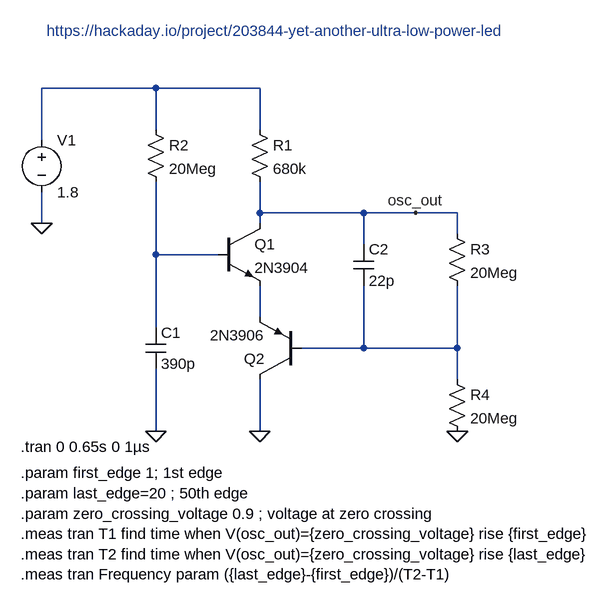
[diagram p0: schematic very_low_power.asc]
very_low_power.asc, the LTspice schematic file:
Version 4
SHEET 1 880 680
WIRE 0 -96 -176 -96
WIRE 160 -96 0 -96
WIRE 0 -32 0 -96
WIRE 160 -32 160 -96
WIRE -176 -16 -176 -96
WIRE 160 96 160 48
WIRE 320 96 160 96
WIRE 400 96 320 96
WIRE 464 96 400 96
WIRE -176 112 -176 64
WIRE 160 112 160 96
WIRE 464 128 464 96
WIRE 320 144 320 96
WIRE 0 160 0 48
WIRE 96 160 0 160
WIRE 160 256 160 208
WIRE 0 272 0 160
WIRE 320 304 320 208
WIRE 320 304 224 304
WIRE 464 304 464 208
WIRE 464 304 320 304
WIRE 464 352 464 304
WIRE 0 432 0 336
WIRE 160 432 160 352
FLAG 0 432 0
FLAG 160 432 0
FLAG 464 432 0
FLAG -176 112 0
FLAG 400 96 osc_out
SYMBOL npn 96 112 R0
SYMATTR InstName Q1
SYMATTR Value 2N3904
SYMBOL pnp 224 352 R180
SYMATTR InstName Q2
SYMATTR Value 2N3906
SYMBOL res 144 -48 R0
SYMATTR InstName R1
SYMATTR Value 680k
SYMBOL res -16 -48 R0
SYMATTR InstName R2
SYMATTR Value 20Meg
SYMBOL cap -16 272 R0
SYMATTR InstName C1
SYMATTR Value 390p
SYMBOL cap 304 144 R0
SYMATTR InstName C2
SYMATTR Value 22p
SYMBOL res 448 112 R0
SYMATTR InstName R3
SYMATTR Value 20Meg
SYMBOL res 448 336 R0
SYMATTR InstName R4
SYMATTR Value 20Meg
SYMBOL voltage -176 -32 R0
SYMATTR InstName V1
SYMATTR Value 1.8
TEXT -208 456 Left 2 !.tran 0 0.65s 0 1µs
TEXT -168 -184 Left 2 ;https://hackaday.io/project/203844-yet-another-ultra-low-power-led
TEXT -208 496 Left 2 !.param first_edge 1; 1st edge\n.param last_edge=20 ; 50th edge\n.param zero_crossing_voltage 0.9 ; voltage at zero crossing\n.meas tran T1 find time when V(osc_out)={zero_crossing_voltage} rise {first_edge}\n.meas tran T2 find time when V(osc_out)={zero_crossing_voltage} rise {last_edge}\n.meas tran Frequency param ({last_edge}-{first_edge})/(T2-T1)

The netlist it stands for:
* very_low_power.asc
Q1 osc_out N002 N003 0 2N3904
Q2 0 N004 N003 0 2N3906
R1 N001 osc_out 680k
R2 N001 N002 20Meg
C1 N002 0 390p
C2 osc_out N004 22p
R3 osc_out N004 20Meg
R4 N004 0 20Meg
V1 N001 0 1.8
.model NPN NPN
.model PNP PNP
.lib standard.bjt
.tran 0 0.65s 0 1µs
* https://hackaday.io/project/203844-yet-another-ultra-low-power-led
.param first_edge 1; 1st edge
.param last_edge=20 ; 50th edge
.param zero_crossing_voltage 0.9 ; voltage at zero crossing
.meas tran T1 find time when V(osc_out)={zero_crossing_voltage} rise {first_edge}
.meas tran T2 find time when V(osc_out)={zero_crossing_voltage} rise {last_edge}
.meas tran Frequency param ({last_edge}-{first_edge})/(T2-T1)
.backanno
.end